# Altium schematic sheet Board_Schematic.SchDoc
size A3; Author: J. Villodres; SheetNumber: 1; SheetTotal: 1
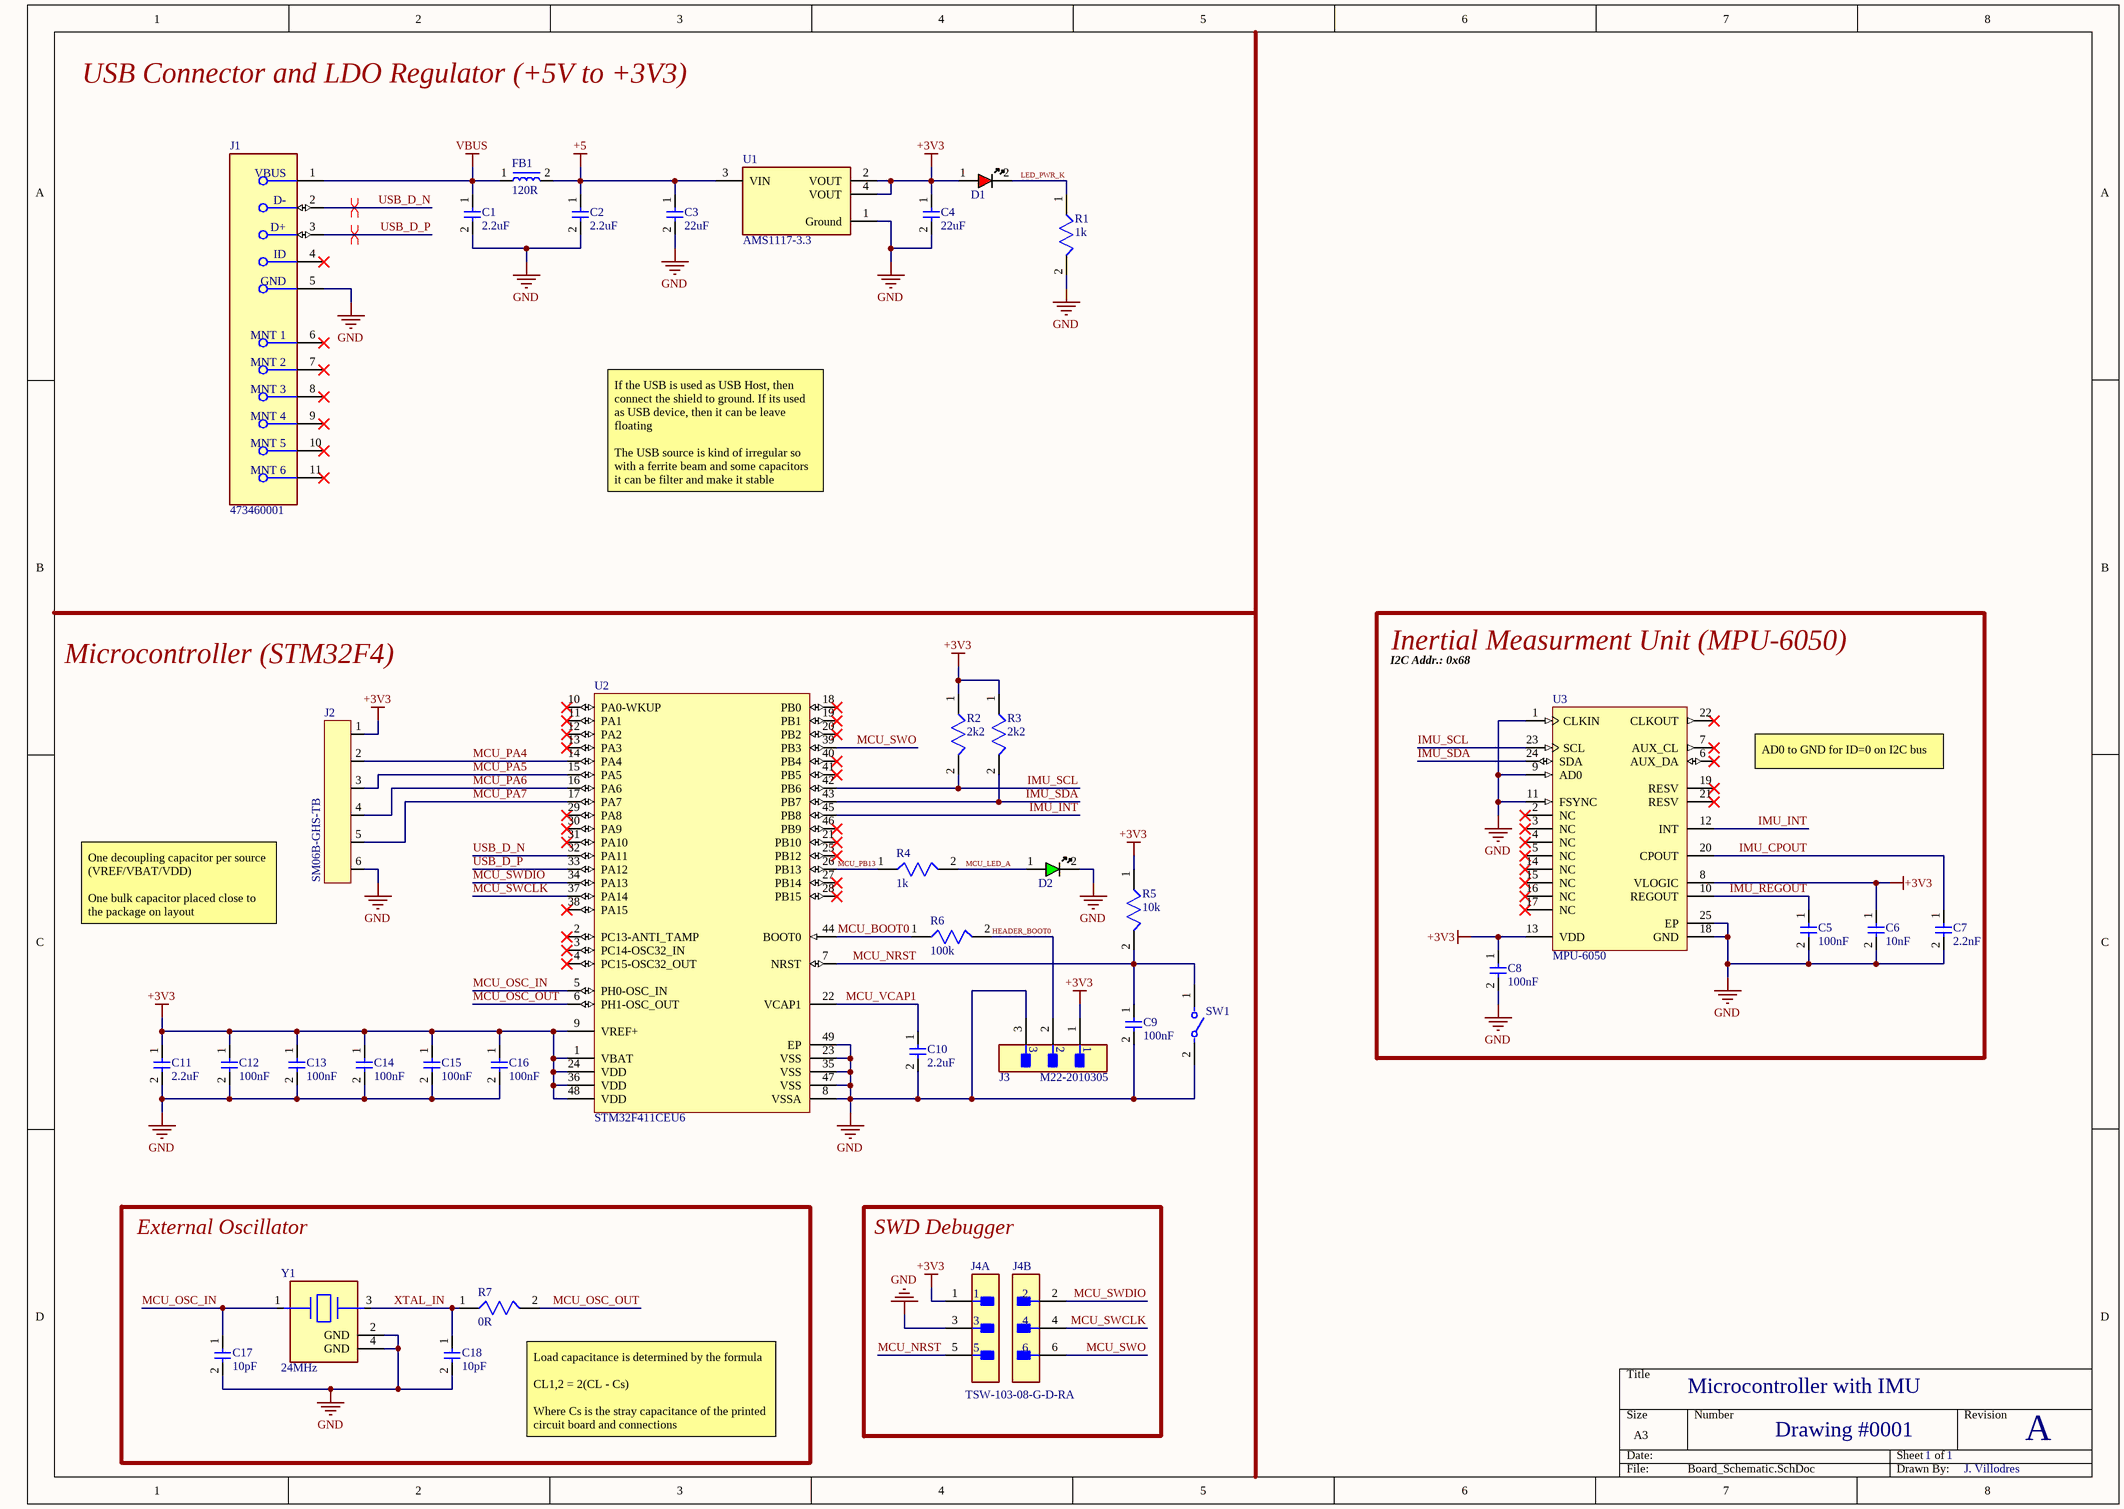
[diagram p0: Board_Schematic.SchDoc]

## Parts
C1  2.2uF  [CAPC1608X90N]
C2  2.2uF  [CAPC1608X90N]
C3  22uF  [CAPC2012X95L]
C4  22uF  [CAPC2012X95L]
C5  100nF  [CAPC1005X55N]
C6  10nF  [CAPC1005X55N]
C7  2.2nF  [CAPC1005X55N]
C8  100nF  [CAPC1005X55N]
C9  100nF  [CAPC1005X55N]
C10  2.2uF  [CAPC1608X90N]
C11  2.2uF  [CAPC1608X90N]
C12  100nF  [CAPC1005X55N]
C13  100nF  [CAPC1005X55N]
C14  100nF  [CAPC1005X55N]
C15  100nF  [CAPC1005X55N]
C16  100nF  [CAPC1005X55N]
C17  10pF  [CAPC1005X55N]
C18  10pF  [CAPC1005X55N]
D1  LED_0402_RED  [LEDC0402]  (value not drawn)
D2  LED_0402_GREEN  [LEDC0402]  (value not drawn)
FB1  120R  [FBC1608X95L]
J1  473460001  [FP-473460001-MFG]
J2  SM06B-GHS-TB  [SM06B-GHS-TB]
J3  M22-2010305  [FP-M22-2010305-MFG]
J4  TSW-103-08-G-D-RA  [FP-TSW-103-08-G-D-RA-MFG]  (parts A,B of 2)
R1  1k  [RESC1005X37L]
R2  2k2  [RESC1005X37L]
R3  2k2  [RESC1005X37L]
R4  1k  [RESC1005X37L]
R5  10k  [RESC1005X37N]
R6  100k  [RESC1005X37N]
R7  0R  [RESC1005X37N]
SW1  147873-2  [FP-147873-2-MFG]  (value not drawn)
U1  AMS1117-3.3  [FP-AMS1117-IPC_C]
U2  STM32F411CEU6  [STM-UFQFPN48_L]
U3  MPU-6050  [IS-QFN-24_V]
Y1  24MHz  [FP-TSX-3225-MFG]

## Blocks framed on the sheet
Inertial Measurment Unit (MPU-6050): C5-C8 U3
External Oscillator: C17 C18 R7 Y1
SWD Debugger: J4

## Nets
+3V3: C4.1 C6.1 C8.1 C11.1 C12.1 C13.1 C14.1 C15.1 C16.1 D1.1(A) J2.1 J3.1 J4.1 R2.1 R3.1 R5.1 U1.2(VOUT) U1.4(VOUT) U2.1(VBAT) U2.9(VREF+) U2.24(VDD) U2.36(VDD) U2.48(VDD) U3.8(VLOGIC) U3.13(VDD)
+5: C2.1 C3.1 FB1.2 U1.3(VIN)
GND: C1.2 C2.2 C3.2 C4.2 C5.2 C6.2 C7.2 C8.2 C9.2 C10.2 C11.2 C12.2 C13.2 C14.2 C15.2 C16.2 C17.2 C18.2 D2.2(K) J1.5(GND) J2.6 J3.3 J4.3 R1.2 SW1.2 U1.1(Ground) U2.8(VSSA) U2.23(VSS) U2.35(VSS) U2.47(VSS) U2.49(EP) U3.1(CLKIN) U3.9(AD0) U3.11(FSYNC) U3.18(GND) U3.25(EP) Y1.2(GND) Y1.4(GND)
VBUS: C1.1 FB1.1 J1.1(VBUS)
HEADER_BOOT0: J3.2 R6.2
IMU_CPOUT: C7.1 U3.20(CPOUT)
IMU_INT: U2.45(PB8) U3.12(INT)
IMU_REGOUT: C5.1 U3.10(REGOUT)
IMU_SCL: R2.2 U2.42(PB6) U3.23(SCL)
IMU_SDA: R3.2 U2.43(PB7) U3.24(SDA)
LED_PWR_K: D1.2(K) R1.1
MCU_BOOT0: R6.1 U2.44(BOOT0)
MCU_LED_A: D2.1(A) R4.2
MCU_NRST: C9.1 J4.5 R5.2 SW1.1 U2.7(NRST)
MCU_OSC_IN: C17.1 U2.5(PH0-OSC_IN) Y1.1
MCU_OSC_OUT: R7.2 U2.6(PH1-OSC_OUT)
MCU_PA4: J2.2 U2.14(PA4)
MCU_PA5: J2.3 U2.15(PA5)
MCU_PA6: J2.4 U2.16(PA6)
MCU_PA7: J2.5 U2.17(PA7)
MCU_PB13: R4.1 U2.26(PB13)
MCU_SWCLK: J4.4 U2.37(PA14)
MCU_SWDIO: J4.2 U2.34(PA13)
MCU_SWO: J4.6 U2.39(PB3)
MCU_VCAP1: C10.1 U2.22(VCAP1)
USB_D_N: J1.2(D-) U2.32(PA11)
USB_D_P: J1.3(D+) U2.33(PA12)
XTAL_IN: C18.1 R7.1 Y1.3

Not connected (* = marked no-connect by the designer): J1 4(ID)* 6(MNT_1)* 7(MNT_2)* 8(MNT_3)* 9(MNT_4)* 10(MNT_5)* 11(MNT_6)*; U2 2(PC13-ANTI_TAMP)* 3(PC14-OSC32_IN)* 4(PC15-OSC32_OUT)* 10(PA0-WKUP)* 11(PA1)* 12(PA2)* 13(PA3)* 18(PB0)* 19(PB1)* 20(PB2)* 21(PB10)* 25(PB12)* 27(PB14)* 28(PB15)* 29(PA8)* 30(PA9)* 31(PA10)* 38(PA15)* 40(PB4)* 41(PB5)* 46(PB9)*; U3 2(NC)* 3(NC)* 4(NC)* 5(NC)* 6(AUX_DA)* 7(AUX_CL)* 14(NC)* 15(NC)* 16(NC)* 17(NC)* 19(RESV)* 21(RESV)* 22(CLKOUT)*

## Layout directives
differential pair; differential pair class DIFF_USB: USB_D_N, USB_D_P

## Notes on the sheet
- USB Connector and LDO Regulator (+5V to +3V3)
- If the USB is used as USB Host, then connect the shield to ground. If its used as USB device, then it can be leave floating
  The USB source is kind of irregular so with a ferrite beam and some capacitors it can be filter and make it stable
- Microcontroller (STM32F4)
- I2C Addr.: 0x68
- AD0 to GND for ID=0 on I2C bus
- One decoupling capacitor per source (VREF/VBAT/VDD)
  One bulk capacitor placed close to the package on layout
- Microcontroller with IMU
- (near R7) Load capacitance is determined by the formula
  CL1,2 = 2(CL - Cs)
  Where Cs is the stray capacitance of the printed circuit board and connections
- Drawing #0001
- 1
- A
- J. Villodres

## Library data of the parts
C1 C2 C10 C11 = CAP_0603_16V: Capacitor SMD 0603 16V
C3 C4 = CAP_0805_16V: Capacitor SMD 0805 16V
C5-C9 C12-C18 = CAP_0402_16V: Capacitor SMD 0402 16V
D1 = LED_0402_RED: LED RED SMD 0402
D2 = LED_0402_GREEN: LED GREEN SMD 0402
FB1 = FB_0603: Ferrite Bead SMD 0603
J1 = CMP-2000-05246-2: CONN RCPT USB2.0 MICRO B SMD R/A; Manufacturer: Molex; Conn Orientation: Right Angle; Is Female: yes; Shielding: true; Pitch: 0.65mm; Number Of Contacts: 5; Voltage Rating: 30V; Current Rating: 1.8A; Device Class L2: USB Connectors; Digikey Description: CONN RCPT USB2.0 MICRO B SMD R/A; Height: 2.945mm; RoHS: TRUE; ComponentLink2Description: Datasheet; Octopart: https://octopart.com/47346-0001-molex-7164928; Automotive: No; Package: 0; Category: Conn; Device Class L1: Connectors; Usb Standard: USB 2.0; Temperature: -30°C to +85°C; Temperature Range Low: -30°C; Footprint Url: https://www.molex.com/pdm_docs/sd/473460001_sd.pdf; ComponentLink2URL: https://www.molex.com/webdocs/datasheets/pdf/en-us/0473460001_IO_CONNECTORS.pdf; Lead Free: Yes; Manufacturer Part Number: 473460001; Contact Material: Gold,Nickel; Temperature Range High: +85°C; Device Class L3: unset
J2 = SM06B-GHS-TB: Header Connector 6-Pin
J3 = CMP-15831-000100-1: CONN HEADER VERT 3POS 2MM; Voltage Rating (AC): 250V; Current Rating: 1A; Contact Resistance: 20mR; Number of Positions: 3; Mated Stacking Heights: 8.6mm; Voltage Rating: 650V; Insulation Resistance: 10GR; Connector Type: Male Pin; Contact Shape: Square; Min Operating Temperature: -55°C; Lead Pitch: 2mm; Contact Plating: Gold; Pitch: 2mm; Max Operating Temperature: 105°C; Color: Black; Series: M22; Orientation: Straight; Number of Contacts: 3; Max Current Rating: 1A; Contact Material: Bronze; Packaging: Bulk; Housing Color: Black; Housing Material: Nylon; Mount: Through Hole; Case/Package: SIL; Working Voltage: 250V; Reach SVHC Compliant: Yes; Number of Rows: 1; Package Quantity: 1000; Insulation Material: Nylon; Length: 6mm; Contact Finish - Mating: GOLD; Depth: 2mm; Contact Type: Male Pin; Insulation Color: Black; Termination: Solder; RoHS Compliant: Yes; Radiation Hardening: No; Flammability Rating: UL94 V-0; Contact Mating Length: 0.138inch; Fastening Type: Pull
J4 = CMP-02766-000904-1: CONN HEADER R/A 6POS 2.54MM; Row Spacing: 0.1inch; Number of Positions: 6; Gender: Male; Max Current Rating: 7.6A; Max Voltage Rating (AC): 450V; Connector Type: Male Pin; Contact Material: Bronze; Mount: Through Hole; Contact Mating Length: 0.23inch; Pitch: 2.54mm; Housing Material: Polyester; Housing Color: Black; Color: Black; Radiation Hardening: No; Orientation: Right Angle; Package Quantity: 1; Max Operating Temperature: 125°C; Min Operating Temperature: -55°C; Number of Contacts: 6; Width: 2.54mm; Number of Rows: 2; Contact Plating: Gold; Termination: Solder; Depth: 12.44mm; Length: 7.62mm; Packaging: Bulk; Lead Free: Lead Free; REACH SVHC: No SVHC
R1-R7 = RES_0402: Resistor SMD 0402
SW1 = CMP-03402-000024-1: SWITCH TACTILE SPST-NO 0.05A 24V; Contact Current Rating: 50mA; Mechanical Life: 40000Cycles; Actuator Length: 0.031inch; Operating Force: 1.77N; Contact Resistance: 100mR; Max Voltage Rating (DC): 12V; Illumination Type: Non-Illuminated; Switch Function: Off-Mom; Actuator Material: Polyphenylene; Throw Configuration: SPST; Switch Travel: 0.25mm; Housing Material: Thermoplastic; Package Quantity: 1; Contact Plating: Silver; Depth: 6.8mm; Electrical Life: 40000Cycles; Color: Black; Length: 3.5mm; Size: 6mm; Material: Polyamide; Height: 4.3mm; Current Rating: 50mA; Case/Package: SMD/SMT; Packaging: Tape and Reel; Mount: Surface Mount; RoHS Compliant: Yes; Voltage Rating (DC): 12V; Max Operating Temperature: 85°C; ELV: Compliant; Min Operating Temperature: -35°C; Lead Free: Lead Free; Termination: J-Bend; Orientation: Straight; Max Current Rating: 50mA; Radiation Hardening: No; Type: Switch; Contact Material: Copper Alloy; Series: FSMJM, Alcoswitch
U1 = CMP-209535-000001-1: LDO Voltage Regulators 1A, 3.3V; Manufacturer: Advanced Monolithic Systems; Dropout Voltage: 1.1V; Output Type: Fixed; Nominal Supply Current: 5mA; Max Power Dissipation: 1.2W; Max Supply Voltage: 15V; Number Of Outputs: 1; Standoff Height: 0.64mm; Max Junction Temp: +125°C; Height: 1.8mm; Package: AMS1117; Device Class L2: Power Management ICs; ComponentLink2Description: Datasheet; ComponentLink2URL: http://www.advanced-monolithic.com/pdf/ds1117.pdf; Category: IC; RoHS: TRUE; Automotive: No; Device Class L1: Integrated Circuits (ICs); Output Current: 1A; Device Class L3: Voltage Regulators - Linear; Temperature: -40°C to +125°C; Output Voltage: 3.3V; Manufacturer Part Number: AMS1117-3.3; Temperature Range Low: -40°C; Octopart: https://octopart.com/ams1117-3.3-advanced+monolithic+systems-25899300; Lead Free: Yes; Ipc Land Pattern Name: SOT229P700X180-4; Temperature Range High: +125°C
U2 = CMP-0243-00165-1: ARM Cortex-M4 32-bit MCU+FPU, 512 KB Flash, 128 KB RAM, 36 I/Os, 48-Pin UFQFPN, -40 to 85 degC, Tray; Operating Frequency(F) (Processor speed) (MHz): 100; FLASH Size (Prog) (kB): 512; Internal RAM Size (kB): 128; I/Os (High Current): 36; Supply Voltage(Vcc) min (V): 1.7; Package Reference: 48-Pin Ultra Thin Fine Pitch Quad Flat No-Lead, 7 x 7 x 0.6 mm Body, 0.5 mm Pitch, Exposed Pad; ComponentLink1Description: Manufacturer URL; ComponentLink1URL: http://www.st.com/; Packing: Tray; Package Description: UFQFPN48; Core: ARM Cortex-M4; ComponentLink2Description: Datasheet; ComponentLink2URL: http://www.st.com/st-web-ui/static/active/en/resource/technical/document/datasheet/DM00115249.pdf; DatasheetVersion: Rev. 6; Mounting Technology: Surface Mount
U3 = CMP-1753-00002-2: 3-Axis Gyroscope, Accelerometer and a Digital Motion Processor(TM) (DMP), 2.375 to 3.46 V, -40 to 85 degC, 24-Pin QFN, RoHS, Tape and Reel; Manufacturer: InvenSense; Featured Product: MPU-60506-Axis,IntegratedI²CSolution; Other Names: 1428-1007-2 / MPU6050; Sensor Type: MotionTracking; Online Catalog: MPU-6000™Series; Unit PriceUSD: Digital; Datasheet Version: Rev. 3.3, 05/2012; Category: Sensors,Transducers; Datasheet URL: http://datasheet.octopart.com/MPU-6050-InvenSense-datasheet-14421344.pdf; Family: Multifunction; Standard Package: 5,000; Manufacturer URL: http://www.invensense.com/; Output Type: Digital; Dynamic Catalog: MPU-6000™Series
Y1 = CMP-36405-000018-1: CRYSTAL 24.0000MHZ 9PF SMD; ESR (Equivalent Series Resistance): 40R; Frequency Stability: 20ppm; Tolerance: 10ppm; Drive Level: 200uW; Min Operating Temperature: -40°C; RoHS Compliant: Yes; Width: 2.5mm; Max Operating Temperature: 105°C; Package Quantity: 250; Load Capacitance: 9pF; Mount: Surface Mount; Lead Free: Lead Free; Height: 0.024inch; Depth: 2.5mm; Frequency: 24MHz; Packaging: Tape and Reel; Series: TSX-3225; Weight: 0.000564oz; Number of Pins: 4; Termination: SMD/SMT; Case/Package: SMD/SMT; Length: 3.2mm; Frequency Tolerance: 10ppm